# EAGLE schematic batman6 (EAGLE 7.5.0)
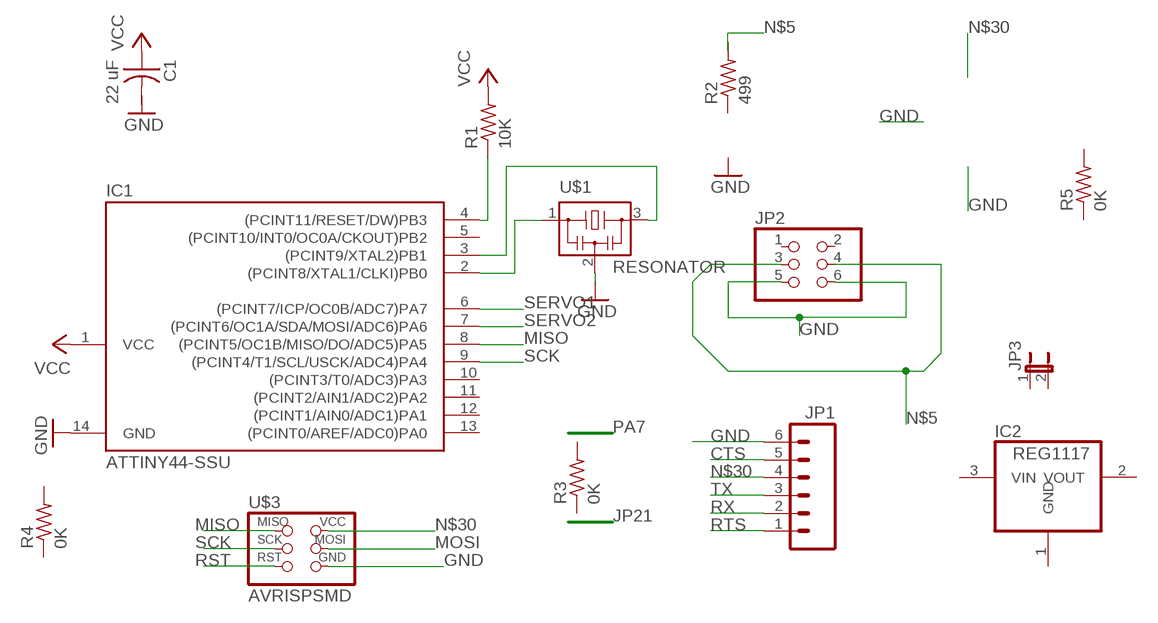
[diagram p0: schematic, sheet 1]

## Parts
C1  22 uF  CAP-US1206  [C1206]
IC1  ATTINY44-SSU  [SOIC14]
IC2  REG1117  [SOT223]
JP1  M06SMD  [1X06-SMD]
JP2  PINHD-2X3-SMD  [2X03SMD]
JP3  JP1E  [JP1]
R1  10K  RES-US1206  [R1206]
R2  499  RES-US1206  [R1206]
R3  0K  RES-US1206  [R1206]
R4  0K  RES-US1206  [R1206]
R5  0K  RES-US1206  [R1206]
U$1  RESONATOR  [EFOBM]
U$3  AVRISPSMD  [2X03SMD]

## Nets
CTS: JP1.5
GND: IC1.14(GND) JP1.6 JP2.5 JP2.6 U$1.2 U$3.6(GND)
JP2: IC1.4((PCINT11/RESET/DW)PB3) R1.1
MISO: IC1.8((PCINT5/OC1B/MISO/DO/ADC5)PA5) U$3.1(MISO)
MOSI: U$3.4(MOSI)
N$3: IC1.2((PCINT8/XTAL1/CLKI)PB0) U$1.1
N$4: IC1.3((PCINT9/XTAL2)PB1) U$1.3
N$5: JP2.3 JP2.4
N$30: C1.1 IC1.1(VCC) JP1.4 R1.2 U$3.2(VCC) ; supply symbol labelled VCC
RST: U$3.5(RST)
RTS: JP1.1
RX: JP1.2
SCK: IC1.9((PCINT4/T1/SCL/USCK/ADC4)PA4) U$3.3(SCK)
SERVO1: IC1.6((PCINT7/ICP/OC0B/ADC7)PA7)
SERVO2: IC1.7((PCINT6/OC1A/SDA/MOSI/ADC6)PA6)
TX: JP1.3
Unconnected: C1.2 IC1.5((PCINT10/INT0/OC0A/CKOUT)PB2) IC1.10((PCINT3/T0/ADC3)PA3) IC1.11((PCINT2/AIN1/ADC2)PA2) IC1.12((PCINT1/AIN0/ADC1)PA1) IC1.13((PCINT0/AREF/ADC0)PA0) IC2.2(VOUT) IC2.3(VIN) JP2.1 JP2.2 JP3.1 JP3.2 R2.1 R2.2 R3.1 R3.2 R4.1 R4.2 R5.1 R5.2

## Power pins joined to a net without a drawn wire
GND: IC2.1(GND)

## Library data of the parts
C1 = fab:CAP-US
IC1 = fab:ATTINY44
IC2 = burr-brown:REG1117: 800mA and 1A Low Dropout (LDO) Positive Regulator 1.8V, 2.5V, 2.85V, 3.3V, 5V, and Adj; MPN: REG1117; OC_FARNELL: 1097566; OC_NEWARK: 14P6981
JP1 = SparkFun:M06: Header 6 Standard 6-pin 0.1" header. Use with straight break away headers (SKU : PRT-00116), right angle break away headers (PRT-00553), swiss pins (PRT-00743), machine pins (PRT-00117), and female headers (PRT-00115). Molex polarized connector foot print use with SKU : PRT-08094 with associated crimp pins and housings. NOTES ON THE VARIANTS LOCK and LOCK_LONGPADS... This footprint was designed to help hold the alignment of a through-hole component (i.e. 6-pin header) while soldering it into place. You may notice that each hole has been shifted either up or down by 0.005 of an inch from it's more standard position (which is a perfectly straight line). This slight alteration caused the pins (the squares in the middle) to touch the edges of the holes. Because they are alternating, it causes a "brace" to hold the component in place. 0.005 has proven to be the perfect amount of "off-center" position when using our standard breakaway headers. Although looks a little odd when you look at the bare footprint, once you have a header in there, the alteration is very hard to notice. Also, if you push a header all the way into place, it is covered up entirely on the bottom side. This idea of altering the position of holes to aid alignment will be further integrated into the Sparkfun Library for other footprints. It can help hold any component with 3 or more connection pins.
JP2 = fab:PINHD-2X3-SMD: PIN HEADER
JP3 = jumper:JP1E: JUMPER
R1-R5 = fab:RES-US: Resistor (US Symbol) Variants with postfix FAB are widened to allow the routing of internal traces
U$1 = fab:RESONATOR
U$3 = fab:AVRISP